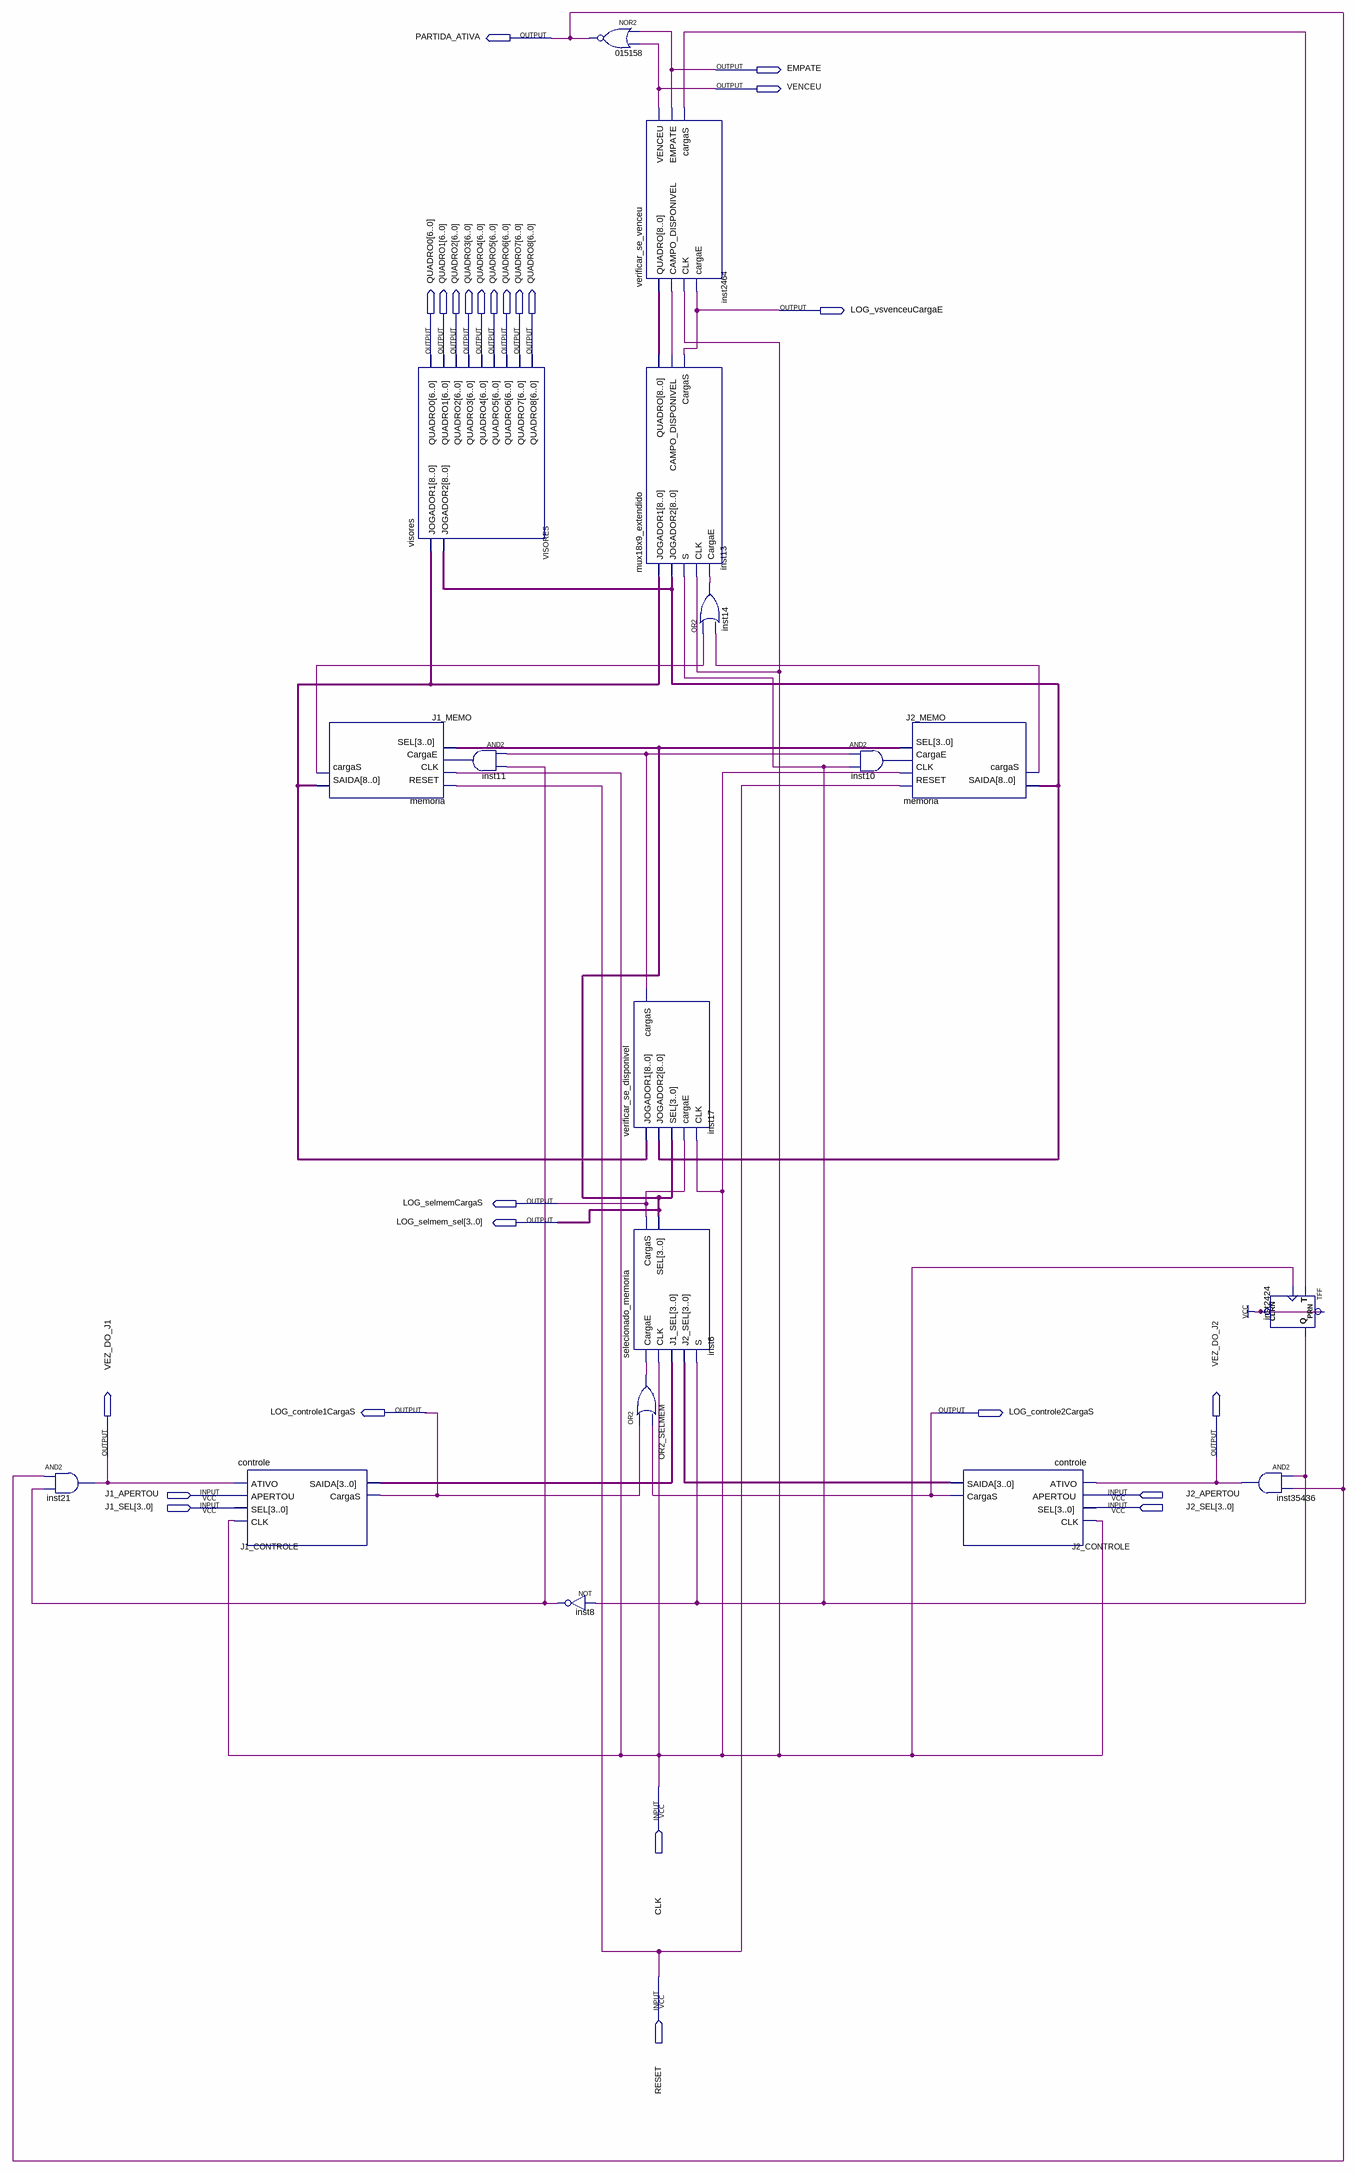
[diagram p0: schematic sheet]
// Quartus schematic jogo_da_velha.bdf as structural Verilog: 18 symbols, 25 pins
module jogo_da_velha (
  input  J1_APERTOU,
  input  J2_APERTOU,
  input  [3:0] J1_SEL,
  input  [3:0] J2_SEL,
  input  CLK,
  input  RESET,
  output PARTIDA_ATIVA,
  output EMPATE,
  output VENCEU,
  output LOG_vsvenceuCargaE,
  output [6:0] QUADRO0,
  output [6:0] QUADRO1,
  output [6:0] QUADRO2,
  output [6:0] QUADRO3,
  output [6:0] QUADRO4,
  output [6:0] QUADRO5,
  output [6:0] QUADRO6,
  output [6:0] QUADRO7,
  output [6:0] QUADRO8,
  output LOG_selmemCargaS,
  output [3:0] LOG_selmem_sel,
  output LOG_controle1CargaS,
  output LOG_controle2CargaS,
  output VEZ_DO_J1,
  output VEZ_DO_J2
);

  wire inst8_out, inst10_out, inst11_out, inst13_campo_disponivel, inst14_out, inst17_cargas, inst2424_q,
       inst2464_cargas, J1_MEMO_cargas, J2_MEMO_cargas, OR2_SELMEM_out;
  wire [3:0] J1_CONTROLE_saida, J2_CONTROLE_saida;
  wire [8:0] inst13_quadro, J1_MEMO_saida, J2_MEMO_saida;

  and inst21 (VEZ_DO_J1, PARTIDA_ATIVA, inst8_out);
  controle J1_CONTROLE (
    .ATIVO(VEZ_DO_J1), .APERTOU(J1_APERTOU), .SEL(J1_SEL), .CLK(CLK), .SAIDA(J1_CONTROLE_saida),
    .CargaS(LOG_controle1CargaS));
  memoria J1_MEMO (
    .RESET(RESET), .CLK(CLK), .CargaE(inst11_out), .SEL(LOG_selmem_sel), .SAIDA(J1_MEMO_saida),
    .cargaS(J1_MEMO_cargas));
  visores VISORES (
    .JOGADOR1(J1_MEMO_saida), .JOGADOR2(J2_MEMO_saida), .QUADRO0(QUADRO0), .QUADRO1(QUADRO1),
    .QUADRO2(QUADRO2), .QUADRO3(QUADRO3), .QUADRO4(QUADRO4), .QUADRO5(QUADRO5), .QUADRO6(QUADRO6),
    .QUADRO7(QUADRO7), .QUADRO8(QUADRO8));
  and inst11 (inst11_out, inst17_cargas, inst8_out);
  not inst8 (inst8_out, inst2424_q);
  nor u_015158 (PARTIDA_ATIVA, EMPATE, VENCEU);
  verificar_se_venceu inst2464 (
    .QUADRO(inst13_quadro), .CAMPO_DISPONIVEL(inst13_campo_disponivel), .CLK(CLK),
    .cargaE(LOG_vsvenceuCargaE), .VENCEU(VENCEU), .EMPATE(EMPATE), .cargaS(inst2464_cargas));
  mux18x9_extendido inst13 (
    .JOGADOR1(J1_MEMO_saida), .JOGADOR2(J2_MEMO_saida), .S(inst2424_q), .CLK(CLK), .CargaE(inst14_out),
    .QUADRO(inst13_quadro), .CAMPO_DISPONIVEL(inst13_campo_disponivel), .CargaS(LOG_vsvenceuCargaE));
  verificar_se_disponivel inst17 (
    .JOGADOR1(J1_MEMO_saida), .JOGADOR2(J2_MEMO_saida), .SEL(LOG_selmem_sel), .cargaE(LOG_selmemCargaS),
    .CLK(CLK), .cargaS(inst17_cargas));
  selecionado_memoria inst6 (
    .CargaE(OR2_SELMEM_out), .CLK(CLK), .J1_SEL(J1_CONTROLE_saida), .J2_SEL(J2_CONTROLE_saida),
    .S(inst2424_q), .CargaS(LOG_selmemCargaS), .SEL(LOG_selmem_sel));
  or OR2_SELMEM (OR2_SELMEM_out, LOG_controle1CargaS, LOG_controle2CargaS);
  or inst14 (inst14_out, J1_MEMO_cargas, J2_MEMO_cargas);
  and inst10 (inst10_out, inst17_cargas, inst2424_q);
  memoria J2_MEMO (
    .RESET(RESET), .CLK(CLK), .CargaE(inst10_out), .SEL(LOG_selmem_sel), .SAIDA(J2_MEMO_saida),
    .cargaS(J2_MEMO_cargas));
  controle J2_CONTROLE (
    .ATIVO(VEZ_DO_J2), .APERTOU(J2_APERTOU), .SEL(J2_SEL), .CLK(CLK), .SAIDA(J2_CONTROLE_saida),
    .CargaS(LOG_controle2CargaS));
  and inst35436 (VEZ_DO_J2, inst2424_q, PARTIDA_ATIVA);
  TFF inst2424 (.PRN(1'b1), .CLRN(1'b1), .T(inst2464_cargas), .CLK(CLK), .Q(inst2424_q));
endmodule
